# Altium project Regulators.PrjPcb
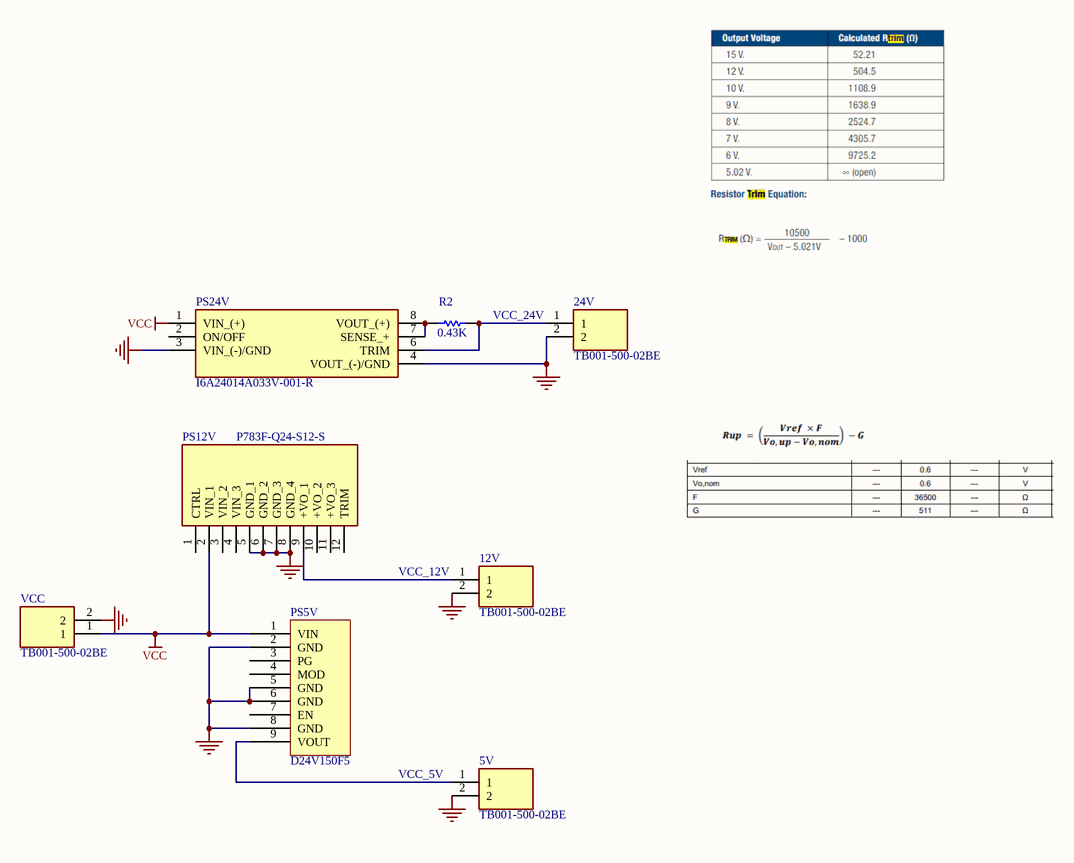
[diagram p0: Regulators.SchDoc]
3 sheets, 25 parts. Net scope: global (net labels, ports and power ports of the same name join across sheets).
Board files: Electronics_REG.PcbDoc, Motor_REG.PcbDoc
Sheets:
  Regulators.SchDoc
  Motor_regulators.SchDoc
  Power_wiring.SchDoc

## Sheet Regulators.SchDoc
size A4

### Parts
(Parts that share a designator on the sheet are numbered #1, #2 ... from top to bottom, then left to right.)
5V  TB001-500-02BE  [TB00150002BE]
12V  TB001-500-02BE  [TB00150002BE]
24V#1  TB001-500-02BE  [TB00150002BE]
PS5V  D24V150F5  [D24V150F5]
PS12V  P783F-Q24-S12-S  [P783FQ24S12S]
PS24V#1  I6A24014A033V-001-R  [I6A24014A033V001R]
R2  value 0.43K  [AXIAL-0.3]  (hidden comment: Res1)
VCC  TB001-500-02BE  [TB00150002BE]

### Nets
GND: 5V.2 12V.2 24V#1.2 PS5V.2(GND) PS5V.5(GND) PS5V.6(GND) PS5V.8(GND) PS12V.5(GND_1) PS12V.6(GND_2) PS12V.7(GND_3) PS12V.8(GND_4) PS24V#1.3(VIN_(-)/GND) PS24V#1.4(VOUT_(-)/GND) VCC.2
VCC: PS5V.1(VIN) PS12V.2(VIN_1) PS24V#1.1(VIN_(+)) VCC.1
Net5V_1: 5V.1 PS5V.9(VOUT)
Net12V_1: 12V.1 PS12V.9(+VO_1)
Net24V#1_1: 24V#1.1 PS24V#1.6(TRIM) R2.1
NetPS24V#1_7: PS24V#1.7(SENSE_+) PS24V#1.8(VOUT_(+)) R2.2

Not connected (* = marked no-connect by the designer): PS5V 3(PG) 4(MOD) 7(EN); PS12V 1(CTRL) 3(VIN_2) 4(VIN_3) 10(+VO_2) 11(+VO_3) 12(TRIM); PS24V#1 2(ON/OFF)

### Notes on the sheet
- VCC_24V
- (near 12V) VCC_12V
- (near 5V) VCC_5V

### Library data of the parts
5V 12V 24V#1 VCC = TB001-500-02BE: Integrated Circuit; Manufacturer_Name: CUI Inc.; Datasheet Link: https://componentsearchengine.com//TB001-500-02BE.pdf; Height: 12.9mm; Mouser2 Part Number: 490-TB001-500-02BE; Mouser2 Price/Stock: https://www.mouser.com/Search/Refine.aspx?Keyword=490-TB001-500-02BE; Manufacturer_Part_Number: TB001-500-02BE
PS5V = D24V150F5: 5V, 15A Step-Down Voltage Regulator
PS12V = P783F-Q24-S12-S: Power Supply; Manufacturer_Name: CUI Inc.; Datasheet Link: https://www.cui.com/product/resource/p783f-s.pdf; Height: 13mm; Manufacturer_Part_Number: P783F-Q24-S12-S
PS24V#1 = I6A24014A033V-001-R: Power Supply; Manufacturer_Name: TDK; Datasheet Link: https://componentsearchengine.com//I6A24014A033V-001-R.pdf; Height: 12.1mm; Mouser2 Part Number: 967-I6A24014A033V001; Mouser2 Price/Stock: https://www.mouser.com/Search/Refine.aspx?Keyword=967-I6A24014A033V001; Manufacturer_Part_Number: I6A24014A033V-001-R
R2 = Res1: Resistor; Published: 8-Jun-2000; LatestRevisionDate: 17-Jul-2002; LatestRevisionNote: Re-released for DXP Platform.; PackageReference: AXIAL-0.3; Publisher: Altium Limited; PackageDescription: Axial Device, Thru-Hole; 2 Leads; 0.3 in Pin Spacing

## Sheet Motor_regulators.SchDoc
size A4
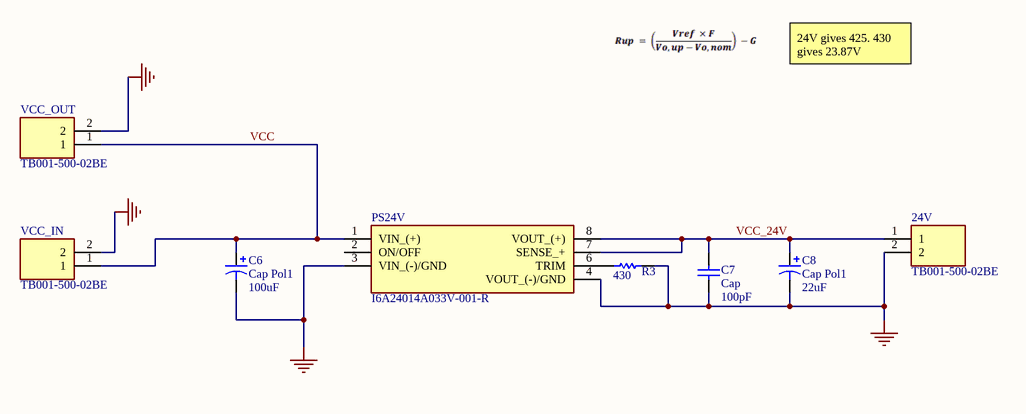
[diagram p1: Motor_regulators.SchDoc]

### Parts
(Parts that share a designator on the sheet are numbered #1, #2 ... from top to bottom, then left to right.)
24V#2  TB001-500-02BE  [TB00150002BE]
C6  Cap Pol1  value 100uF  [RB7.6-15]
C7  Cap  value 100pF  [RAD-0.3]
C8  Cap Pol1  value 22uF  [RB7.6-15]
PS24V#2  I6A24014A033V-001-R  [I6A24014A033V001R]
R3  value 430  [AXIAL-0.3]  (hidden comment: Rup)
VCC_IN  TB001-500-02BE  [TB00150002BE]
VCC_OUT  TB001-500-02BE  [TB00150002BE]

### Nets
GND: 24V#2.2 C6.2 C7.1 C8.2 PS24V#2.3(VIN_(-)/GND) PS24V#2.4(VOUT_(-)/GND) R3.1 VCC_IN.2 VCC_OUT.2
VCC: C6.1 PS24V#2.1(VIN_(+)) VCC_IN.1 VCC_OUT.1
VCC_24V: 24V#2.1 C7.2 C8.1 PS24V#2.7(SENSE_+) PS24V#2.8(VOUT_(+))
NetPS24V#2_6: PS24V#2.6(TRIM) R3.2

Not connected (* = marked no-connect by the designer): PS24V#2 2(ON/OFF)

### Notes on the sheet
- 24V gives 425. 430 gives 23.87V

### Library data of the parts
24V#2 VCC_IN VCC_OUT = TB001-500-02BE: as 5V on sheet Regulators; Datasheet Link: https://componentsearchengine.com//TB001-500-02BE.pdf; Height: 12.9mm; Mouser2 Part Number: 490-TB001-500-02BE; Mouser2 Price/Stock: https://www.mouser.com/Search/Refine.aspx?Keyword=490-TB001-500-02BE; Manufacturer_Part_Number: TB001-500-02BE
C6 C8 = Cap Pol1: Polarized Capacitor (Radial); Published: 8-Jun-2000; LatestRevisionDate: 17-Jul-2002; LatestRevisionNote: Re-released for DXP Platform.; PackageReference: RB7.6-15; Publisher: Altium Limited; PackageDescription: Polarized Capacitor (Radial); 2 Leads
C7 = Cap: Capacitor; Published: 8-Jun-2000; LatestRevisionDate: 17-Jul-2002; LatestRevisionNote: Re-released for DXP Platform.; PackageReference: RAD-0.3; Publisher: Altium Limited; PackageDescription: Radial Cap, Thru-Hole; 2 Leads; 0.3 in Pin Spacing
PS24V#2 = I6A24014A033V-001-R: Power Supply; Manufacturer_Name: TDK; Datasheet Link: https://componentsearchengine.com//I6A24014A033V-001-R.pdf; Height: 12.1mm; Mouser2 Part Number: 967-I6A24014A033V001; Mouser2 Price/Stock: https://www.mouser.com/Search/Refine.aspx?Keyword=967-I6A24014A033V001; Manufacturer_Part_Number: I6A24014A033V-001-R
R3 = Res1: Resistor; Published: 8-Jun-2000; LatestRevisionDate: 17-Jul-2002; LatestRevisionNote: Re-released for DXP Platform.; PackageReference: AXIAL-0.3; Publisher: Altium Limited; PackageDescription: Axial Device, Thru-Hole; 2 Leads; 0.3 in Pin Spacing

## Sheet Power_wiring.SchDoc
size A4
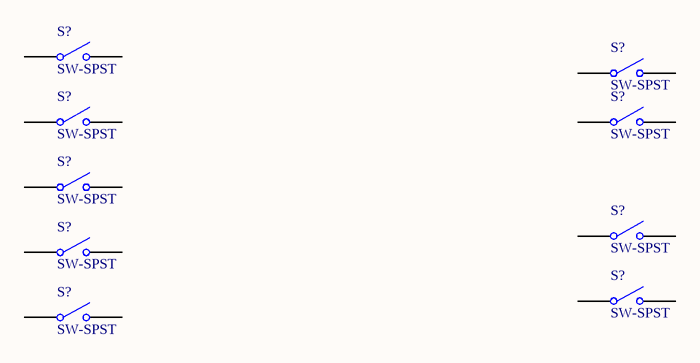
[diagram p2: Power_wiring.SchDoc]

### Parts
(Parts that share a designator on the sheet are numbered #1, #2 ... from top to bottom, then left to right.)
S?#1  SW-SPST  [SPST-2]
S?#2  SW-SPST  [SPST-2]
S?#3  SW-SPST  [SPST-2]
S?#4  SW-SPST  [SPST-2]
S?#5  SW-SPST  [SPST-2]
S?#6  SW-SPST  [SPST-2]
S?#7  SW-SPST  [SPST-2]
S?#8  SW-SPST  [SPST-2]
S?#9  SW-SPST  [SPST-2]

### Nets

Not connected (* = marked no-connect by the designer): S?#1 1(COMMON) 2(NO); S?#2 1(COMMON) 2(NO); S?#3 1(COMMON) 2(NO); S?#4 1(COMMON) 2(NO); S?#5 1(COMMON) 2(NO); S?#6 1(COMMON) 2(NO); S?#7 1(COMMON) 2(NO); S?#8 1(COMMON) 2(NO); S?#9 1(COMMON) 2(NO)

### Library data of the parts
S?#1-S?#9 = SW-SPST: Single-Pole, Single-Throw Switch; Published: 24-Mar-1999; LatestRevisionDate: 17-Jul-2002; LatestRevisionNote: Re-released for DXP Platform.; PackageReference: SPST-2; Publisher: Altium Limited; PackageDescription: Switch; 2 Leads

## Nets that join several sheets
GND: Regulators (14 pins), Motor_regulators (9 pins)
VCC: Regulators (PS5V.1 PS12V.2 PS24V#1.1 VCC.1), Motor_regulators (C6.1 PS24V#2.1 VCC_IN.1 VCC_OUT.1)